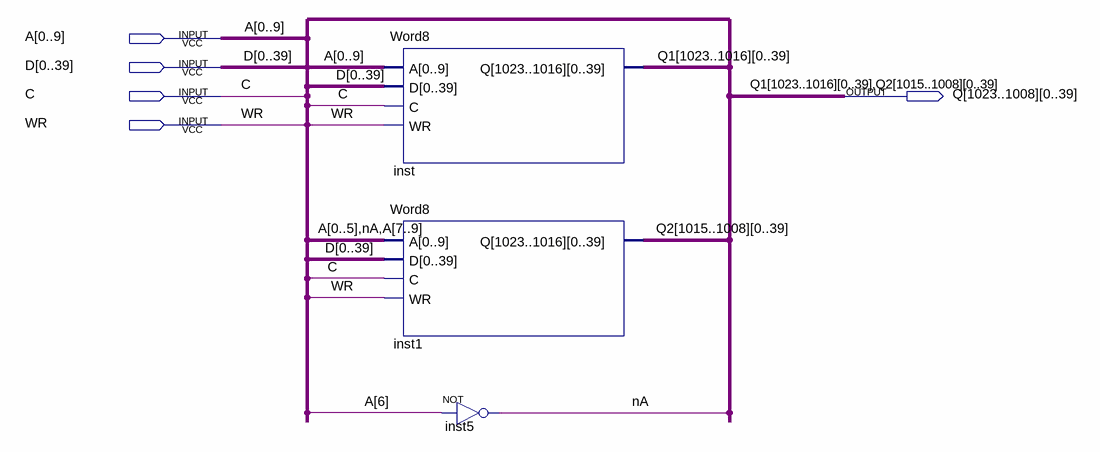
[diagram p0: schematic sheet]
// Quartus schematic Word16.bdf as structural Verilog: 3 symbols, 5 pins
module Word16 (
  input  [0:9] A,
  input  [0:39] D,
  input  C,
  input  WR,
  output [39:0] Q_1023,
  output [39:0] Q_1022,
  output [39:0] Q_1021,
  output [39:0] Q_1020,
  output [39:0] Q_1019,
  output [39:0] Q_1018,
  output [39:0] Q_1017,
  output [39:0] Q_1016,
  output [39:0] Q_1015,
  output [39:0] Q_1014,
  output [39:0] Q_1013,
  output [39:0] Q_1012,
  output [39:0] Q_1011,
  output [39:0] Q_1010,
  output [39:0] Q_1009,
  output [39:0] Q_1008
);

  wire nA;

  Word8 inst (
    .A(A), .D(D), .C(C), .WR(WR),
    .Q({Q_1023[0], Q_1023[1], Q_1023[2], Q_1023[3], Q_1023[4], Q_1023[5], Q_1023[6], Q_1023[7], Q_1023[8], Q_1023[9], Q_1023[10], Q_1023[11], Q_1023[12], Q_1023[13], Q_1023[14], Q_1023[15], Q_1023[16], Q_1023[17], Q_1023[18], Q_1023[19], Q_1023[20], Q_1023[21], Q_1023[22], Q_1023[23], Q_1023[24], Q_1023[25], Q_1023[26], Q_1023[27], Q_1023[28], Q_1023[29], Q_1023[30], Q_1023[31], Q_1023[32], Q_1023[33], Q_1023[34], Q_1023[35], Q_1023[36], Q_1023[37], Q_1023[38], Q_1023[39], Q_1022[0], Q_1022[1], Q_1022[2], Q_1022[3], Q_1022[4], Q_1022[5], Q_1022[6], Q_1022[7], Q_1022[8], Q_1022[9], Q_1022[10], Q_1022[11], Q_1022[12], Q_1022[13], Q_1022[14], Q_1022[15], Q_1022[16], Q_1022[17], Q_1022[18], Q_1022[19], Q_1022[20], Q_1022[21], Q_1022[22], Q_1022[23], Q_1022[24], Q_1022[25], Q_1022[26], Q_1022[27], Q_1022[28], Q_1022[29], Q_1022[30], Q_1022[31], Q_1022[32], Q_1022[33], Q_1022[34], Q_1022[35], Q_1022[36], Q_1022[37], Q_1022[38], Q_1022[39], Q_1021[0], Q_1021[1], Q_1021[2], Q_1021[3], Q_1021[4], Q_1021[5], Q_1021[6], Q_1021[7], Q_1021[8], Q_1021[9], Q_1021[10], Q_1021[11], Q_1021[12], Q_1021[13], Q_1021[14], Q_1021[15], Q_1021[16], Q_1021[17], Q_1021[18], Q_1021[19], Q_1021[20], Q_1021[21], Q_1021[22], Q_1021[23], Q_1021[24], Q_1021[25], Q_1021[26], Q_1021[27], Q_1021[28], Q_1021[29], Q_1021[30], Q_1021[31], Q_1021[32], Q_1021[33], Q_1021[34], Q_1021[35], Q_1021[36], Q_1021[37], Q_1021[38], Q_1021[39], Q_1020[0], Q_1020[1], Q_1020[2], Q_1020[3], Q_1020[4], Q_1020[5], Q_1020[6], Q_1020[7], Q_1020[8], Q_1020[9], Q_1020[10], Q_1020[11], Q_1020[12], Q_1020[13], Q_1020[14], Q_1020[15], Q_1020[16], Q_1020[17], Q_1020[18], Q_1020[19], Q_1020[20], Q_1020[21], Q_1020[22], Q_1020[23], Q_1020[24], Q_1020[25], Q_1020[26], Q_1020[27], Q_1020[28], Q_1020[29], Q_1020[30], Q_1020[31], Q_1020[32], Q_1020[33], Q_1020[34], Q_1020[35], Q_1020[36], Q_1020[37], Q_1020[38], Q_1020[39], Q_1019[0], Q_1019[1], Q_1019[2], Q_1019[3], Q_1019[4], Q_1019[5], Q_1019[6], Q_1019[7], Q_1019[8], Q_1019[9], Q_1019[10], Q_1019[11], Q_1019[12], Q_1019[13], Q_1019[14], Q_1019[15], Q_1019[16], Q_1019[17], Q_1019[18], Q_1019[19], Q_1019[20], Q_1019[21], Q_1019[22], Q_1019[23], Q_1019[24], Q_1019[25], Q_1019[26], Q_1019[27], Q_1019[28], Q_1019[29], Q_1019[30], Q_1019[31], Q_1019[32], Q_1019[33], Q_1019[34], Q_1019[35], Q_1019[36], Q_1019[37], Q_1019[38], Q_1019[39], Q_1018[0], Q_1018[1], Q_1018[2], Q_1018[3], Q_1018[4], Q_1018[5], Q_1018[6], Q_1018[7], Q_1018[8], Q_1018[9], Q_1018[10], Q_1018[11], Q_1018[12], Q_1018[13], Q_1018[14], Q_1018[15], Q_1018[16], Q_1018[17], Q_1018[18], Q_1018[19], Q_1018[20], Q_1018[21], Q_1018[22], Q_1018[23], Q_1018[24], Q_1018[25], Q_1018[26], Q_1018[27], Q_1018[28], Q_1018[29], Q_1018[30], Q_1018[31], Q_1018[32], Q_1018[33], Q_1018[34], Q_1018[35], Q_1018[36], Q_1018[37], Q_1018[38], Q_1018[39], Q_1017[0], Q_1017[1], Q_1017[2], Q_1017[3], Q_1017[4], Q_1017[5], Q_1017[6], Q_1017[7], Q_1017[8], Q_1017[9], Q_1017[10], Q_1017[11], Q_1017[12], Q_1017[13], Q_1017[14], Q_1017[15], Q_1017[16], Q_1017[17], Q_1017[18], Q_1017[19], Q_1017[20], Q_1017[21], Q_1017[22], Q_1017[23], Q_1017[24], Q_1017[25], Q_1017[26], Q_1017[27], Q_1017[28], Q_1017[29], Q_1017[30], Q_1017[31], Q_1017[32], Q_1017[33], Q_1017[34], Q_1017[35], Q_1017[36], Q_1017[37], Q_1017[38], Q_1017[39], Q_1016[0], Q_1016[1], Q_1016[2], Q_1016[3], Q_1016[4], Q_1016[5], Q_1016[6], Q_1016[7], Q_1016[8], Q_1016[9], Q_1016[10], Q_1016[11], Q_1016[12], Q_1016[13], Q_1016[14], Q_1016[15], Q_1016[16], Q_1016[17], Q_1016[18], Q_1016[19], Q_1016[20], Q_1016[21], Q_1016[22], Q_1016[23], Q_1016[24], Q_1016[25], Q_1016[26], Q_1016[27], Q_1016[28], Q_1016[29], Q_1016[30], Q_1016[31], Q_1016[32], Q_1016[33], Q_1016[34], Q_1016[35], Q_1016[36], Q_1016[37], Q_1016[38], Q_1016[39]}));
  Word8 inst1 (
    .A({A[0:5], nA, A[7:9]}), .D(D), .C(C), .WR(WR),
    .Q({Q_1015[0], Q_1015[1], Q_1015[2], Q_1015[3], Q_1015[4], Q_1015[5], Q_1015[6], Q_1015[7], Q_1015[8], Q_1015[9], Q_1015[10], Q_1015[11], Q_1015[12], Q_1015[13], Q_1015[14], Q_1015[15], Q_1015[16], Q_1015[17], Q_1015[18], Q_1015[19], Q_1015[20], Q_1015[21], Q_1015[22], Q_1015[23], Q_1015[24], Q_1015[25], Q_1015[26], Q_1015[27], Q_1015[28], Q_1015[29], Q_1015[30], Q_1015[31], Q_1015[32], Q_1015[33], Q_1015[34], Q_1015[35], Q_1015[36], Q_1015[37], Q_1015[38], Q_1015[39], Q_1014[0], Q_1014[1], Q_1014[2], Q_1014[3], Q_1014[4], Q_1014[5], Q_1014[6], Q_1014[7], Q_1014[8], Q_1014[9], Q_1014[10], Q_1014[11], Q_1014[12], Q_1014[13], Q_1014[14], Q_1014[15], Q_1014[16], Q_1014[17], Q_1014[18], Q_1014[19], Q_1014[20], Q_1014[21], Q_1014[22], Q_1014[23], Q_1014[24], Q_1014[25], Q_1014[26], Q_1014[27], Q_1014[28], Q_1014[29], Q_1014[30], Q_1014[31], Q_1014[32], Q_1014[33], Q_1014[34], Q_1014[35], Q_1014[36], Q_1014[37], Q_1014[38], Q_1014[39], Q_1013[0], Q_1013[1], Q_1013[2], Q_1013[3], Q_1013[4], Q_1013[5], Q_1013[6], Q_1013[7], Q_1013[8], Q_1013[9], Q_1013[10], Q_1013[11], Q_1013[12], Q_1013[13], Q_1013[14], Q_1013[15], Q_1013[16], Q_1013[17], Q_1013[18], Q_1013[19], Q_1013[20], Q_1013[21], Q_1013[22], Q_1013[23], Q_1013[24], Q_1013[25], Q_1013[26], Q_1013[27], Q_1013[28], Q_1013[29], Q_1013[30], Q_1013[31], Q_1013[32], Q_1013[33], Q_1013[34], Q_1013[35], Q_1013[36], Q_1013[37], Q_1013[38], Q_1013[39], Q_1012[0], Q_1012[1], Q_1012[2], Q_1012[3], Q_1012[4], Q_1012[5], Q_1012[6], Q_1012[7], Q_1012[8], Q_1012[9], Q_1012[10], Q_1012[11], Q_1012[12], Q_1012[13], Q_1012[14], Q_1012[15], Q_1012[16], Q_1012[17], Q_1012[18], Q_1012[19], Q_1012[20], Q_1012[21], Q_1012[22], Q_1012[23], Q_1012[24], Q_1012[25], Q_1012[26], Q_1012[27], Q_1012[28], Q_1012[29], Q_1012[30], Q_1012[31], Q_1012[32], Q_1012[33], Q_1012[34], Q_1012[35], Q_1012[36], Q_1012[37], Q_1012[38], Q_1012[39], Q_1011[0], Q_1011[1], Q_1011[2], Q_1011[3], Q_1011[4], Q_1011[5], Q_1011[6], Q_1011[7], Q_1011[8], Q_1011[9], Q_1011[10], Q_1011[11], Q_1011[12], Q_1011[13], Q_1011[14], Q_1011[15], Q_1011[16], Q_1011[17], Q_1011[18], Q_1011[19], Q_1011[20], Q_1011[21], Q_1011[22], Q_1011[23], Q_1011[24], Q_1011[25], Q_1011[26], Q_1011[27], Q_1011[28], Q_1011[29], Q_1011[30], Q_1011[31], Q_1011[32], Q_1011[33], Q_1011[34], Q_1011[35], Q_1011[36], Q_1011[37], Q_1011[38], Q_1011[39], Q_1010[0], Q_1010[1], Q_1010[2], Q_1010[3], Q_1010[4], Q_1010[5], Q_1010[6], Q_1010[7], Q_1010[8], Q_1010[9], Q_1010[10], Q_1010[11], Q_1010[12], Q_1010[13], Q_1010[14], Q_1010[15], Q_1010[16], Q_1010[17], Q_1010[18], Q_1010[19], Q_1010[20], Q_1010[21], Q_1010[22], Q_1010[23], Q_1010[24], Q_1010[25], Q_1010[26], Q_1010[27], Q_1010[28], Q_1010[29], Q_1010[30], Q_1010[31], Q_1010[32], Q_1010[33], Q_1010[34], Q_1010[35], Q_1010[36], Q_1010[37], Q_1010[38], Q_1010[39], Q_1009[0], Q_1009[1], Q_1009[2], Q_1009[3], Q_1009[4], Q_1009[5], Q_1009[6], Q_1009[7], Q_1009[8], Q_1009[9], Q_1009[10], Q_1009[11], Q_1009[12], Q_1009[13], Q_1009[14], Q_1009[15], Q_1009[16], Q_1009[17], Q_1009[18], Q_1009[19], Q_1009[20], Q_1009[21], Q_1009[22], Q_1009[23], Q_1009[24], Q_1009[25], Q_1009[26], Q_1009[27], Q_1009[28], Q_1009[29], Q_1009[30], Q_1009[31], Q_1009[32], Q_1009[33], Q_1009[34], Q_1009[35], Q_1009[36], Q_1009[37], Q_1009[38], Q_1009[39], Q_1008[0], Q_1008[1], Q_1008[2], Q_1008[3], Q_1008[4], Q_1008[5], Q_1008[6], Q_1008[7], Q_1008[8], Q_1008[9], Q_1008[10], Q_1008[11], Q_1008[12], Q_1008[13], Q_1008[14], Q_1008[15], Q_1008[16], Q_1008[17], Q_1008[18], Q_1008[19], Q_1008[20], Q_1008[21], Q_1008[22], Q_1008[23], Q_1008[24], Q_1008[25], Q_1008[26], Q_1008[27], Q_1008[28], Q_1008[29], Q_1008[30], Q_1008[31], Q_1008[32], Q_1008[33], Q_1008[34], Q_1008[35], Q_1008[36], Q_1008[37], Q_1008[38], Q_1008[39]}));
  not inst5 (nA, A[6]);

  // Other names for the same wires on the sheet: Q1_1016[39:0] = Q_1016; Q1_1017[39:0] = Q_1017;
  //   Q1_1018[39:0] = Q_1018; Q1_1019[39:0] = Q_1019; Q1_1020[39:0] = Q_1020; Q1_1021[39:0] = Q_1021;
  //   Q1_1022[39:0] = Q_1022; Q1_1023[39:0] = Q_1023; Q2_1008[39:0] = Q_1008; Q2_1009[39:0] = Q_1009;
  //   Q2_1010[39:0] = Q_1010; Q2_1011[39:0] = Q_1011; Q2_1012[39:0] = Q_1012; Q2_1013[39:0] = Q_1013;
  //   Q2_1014[39:0] = Q_1014; Q2_1015[39:0] = Q_1015
endmodule
